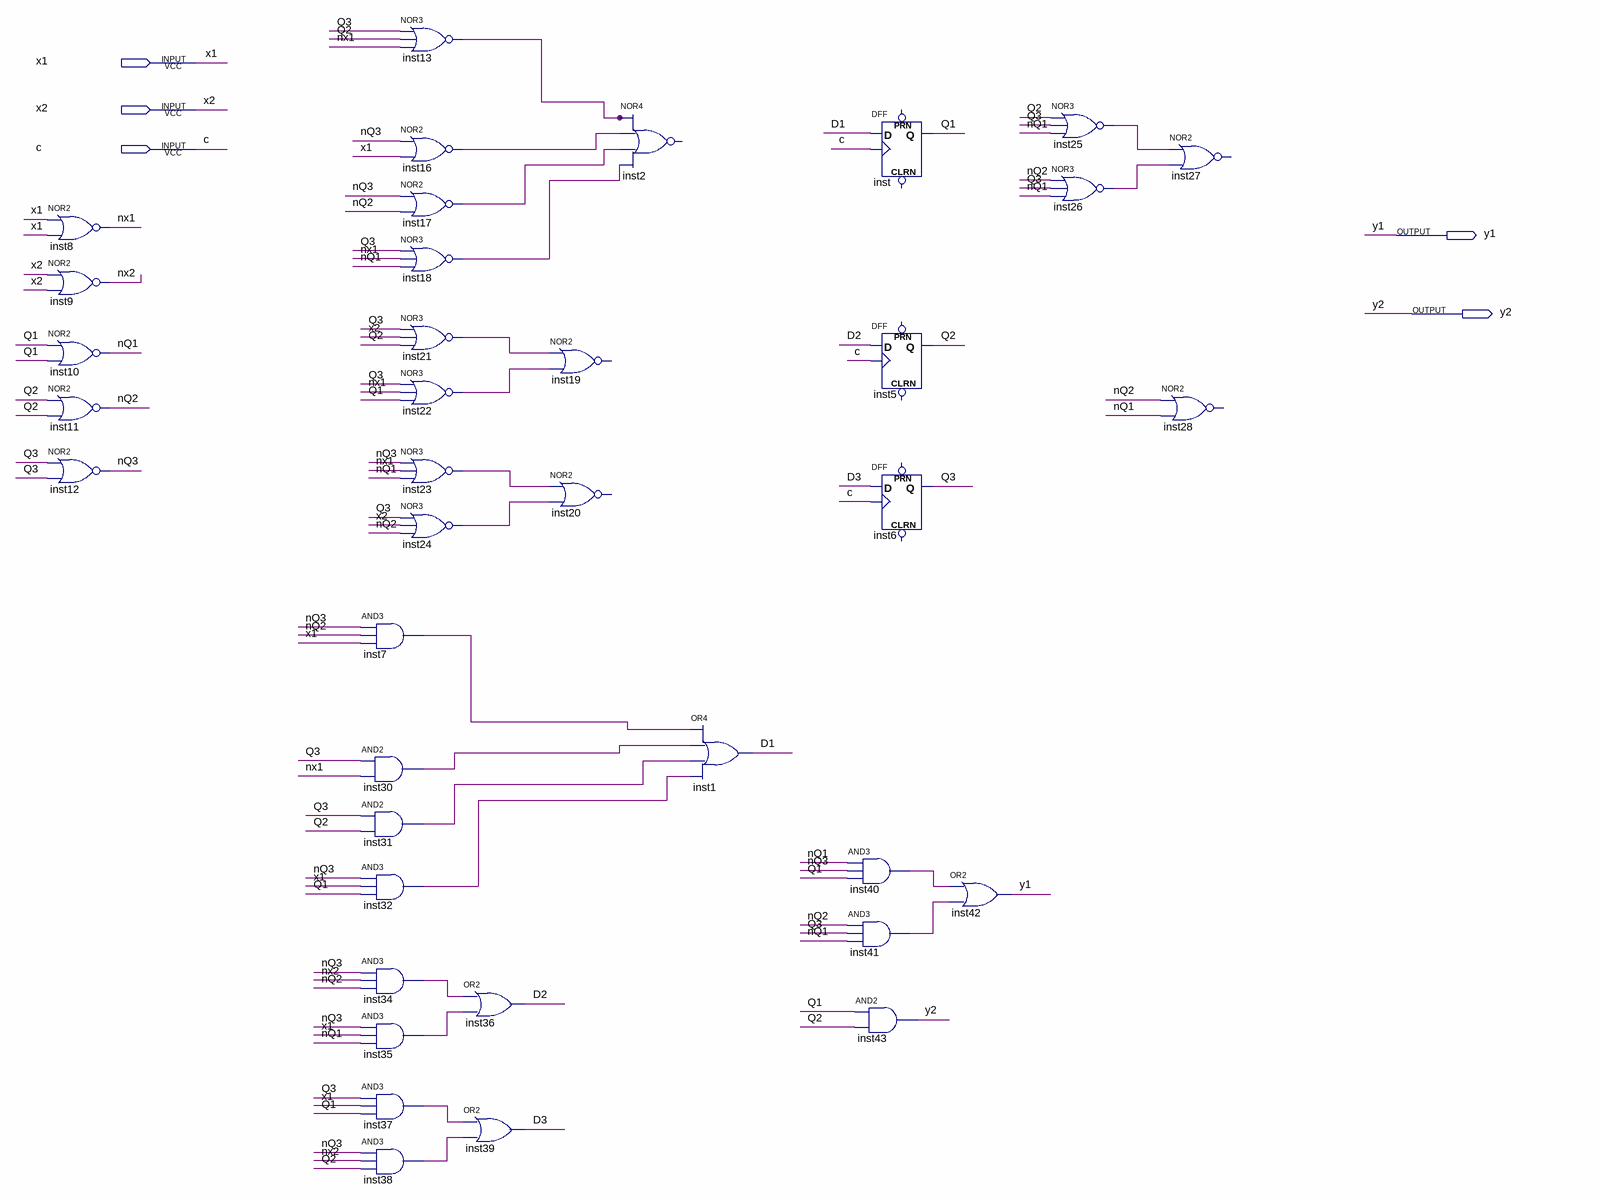
[diagram p0: schematic sheet]
// Quartus schematic lab.bdf as structural Verilog: 38 symbols, 5 pins
module lab (
  input  x1,
  input  x2,
  input  c,
  output y1,
  output y2
);

  wire D1, D2, D3, inst7_out, inst13_out, inst16_out, inst17_out, inst18_out, inst21_out, inst22_out,
       inst23_out, inst24_out, inst25_out, inst26_out, inst30_out, inst31_out, inst32_out, inst34_out,
       inst35_out, inst37_out, inst38_out, inst40_out, inst41_out, nQ1, nQ2, nQ3, nx1, nx2, Q1, Q2, Q3;

  nor inst8 (nx1, x1, x1);
  nor inst9 (nx2, x2, x2);
  nor inst10 (nQ1, Q1, Q1);
  nor inst11 (nQ2, Q2, Q2);
  nor inst12 (nQ3, Q3, Q3);
  and inst7 (inst7_out, nQ3, nQ2, x1);
  and inst30 (inst30_out, Q3, nx1);
  and inst31 (inst31_out, Q3, Q2);
  and inst32 (inst32_out, nQ3, x1, Q1);
  and inst34 (inst34_out, nQ3, nx2, nQ2);
  and inst35 (inst35_out, nQ3, x1, nQ1);
  and inst37 (inst37_out, Q3, x1, Q1);
  and inst38 (inst38_out, nQ3, nx2, Q2);
  nor inst13 (inst13_out, Q3, Q2, nx1);
  nor inst16 (inst16_out, nQ3, x1);
  nor inst17 (inst17_out, nQ3, nQ2);
  nor inst18 (inst18_out, Q3, nx1, nQ1);
  nor inst21 (inst21_out, Q3, x2, Q2);
  nor inst22 (inst22_out, Q3, nx1, Q1);
  nor inst23 (inst23_out, nQ3, nx1, nQ1);
  nor inst24 (inst24_out, Q3, x2, nQ2);
  or inst36 (D2, inst34_out, inst35_out);
  or inst39 (D3, inst37_out, inst38_out);
  // NOR2 inst19 has open pins: IN1=inst21_out, IN2=inst22_out, OUT=open
  // NOR2 inst20 has open pins: IN1=inst23_out, IN2=inst24_out, OUT=open
  // NOR4 inst2 has open pins: IN1=inst13_out, IN2=inst16_out, IN3=inst17_out, IN4=inst18_out, OUT=open
  or inst1 (D1, inst7_out, inst30_out, inst31_out, inst32_out);
  DFF inst (.CLK(c), .D(D1), .Q(Q1));  // open: CLRN, PRN
  DFF inst5 (.CLK(c), .D(D2), .Q(Q2));  // open: CLRN, PRN
  DFF inst6 (.CLK(c), .D(D3), .Q(Q3));  // open: CLRN, PRN
  and inst40 (inst40_out, nQ1, nQ3, Q1);
  and inst41 (inst41_out, nQ2, Q3, nQ1);
  and inst43 (y2, Q1, Q2);
  or inst42 (y1, inst40_out, inst41_out);
  nor inst25 (inst25_out, Q2, Q3, nQ1);
  nor inst26 (inst26_out, nQ2, Q3, nQ1);
  // NOR2 inst27 has open pins: IN1=inst25_out, IN2=inst26_out, OUT=open
  // NOR2 inst28 has open pins: IN1=nQ2, IN2=nQ1, OUT=open
endmodule
